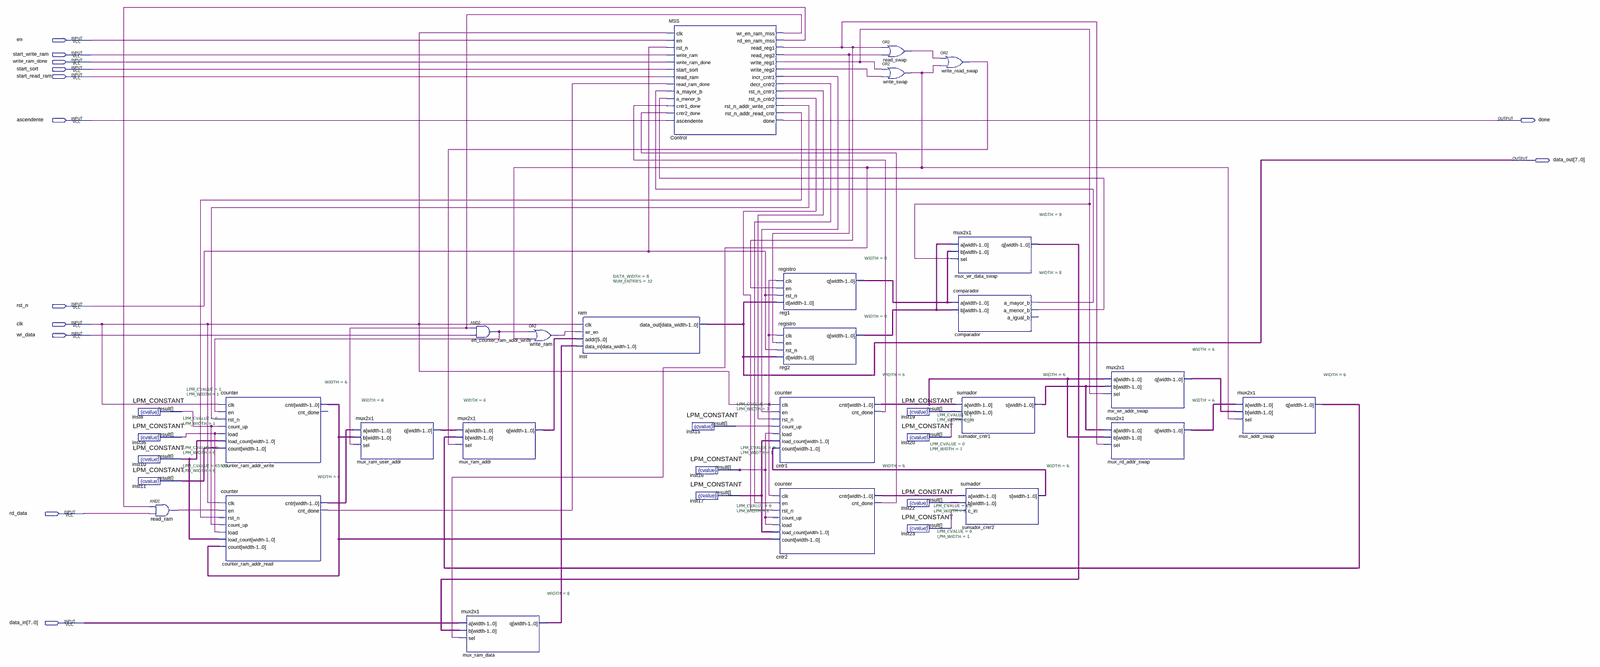
[diagram p0: schematic sheet, whole]
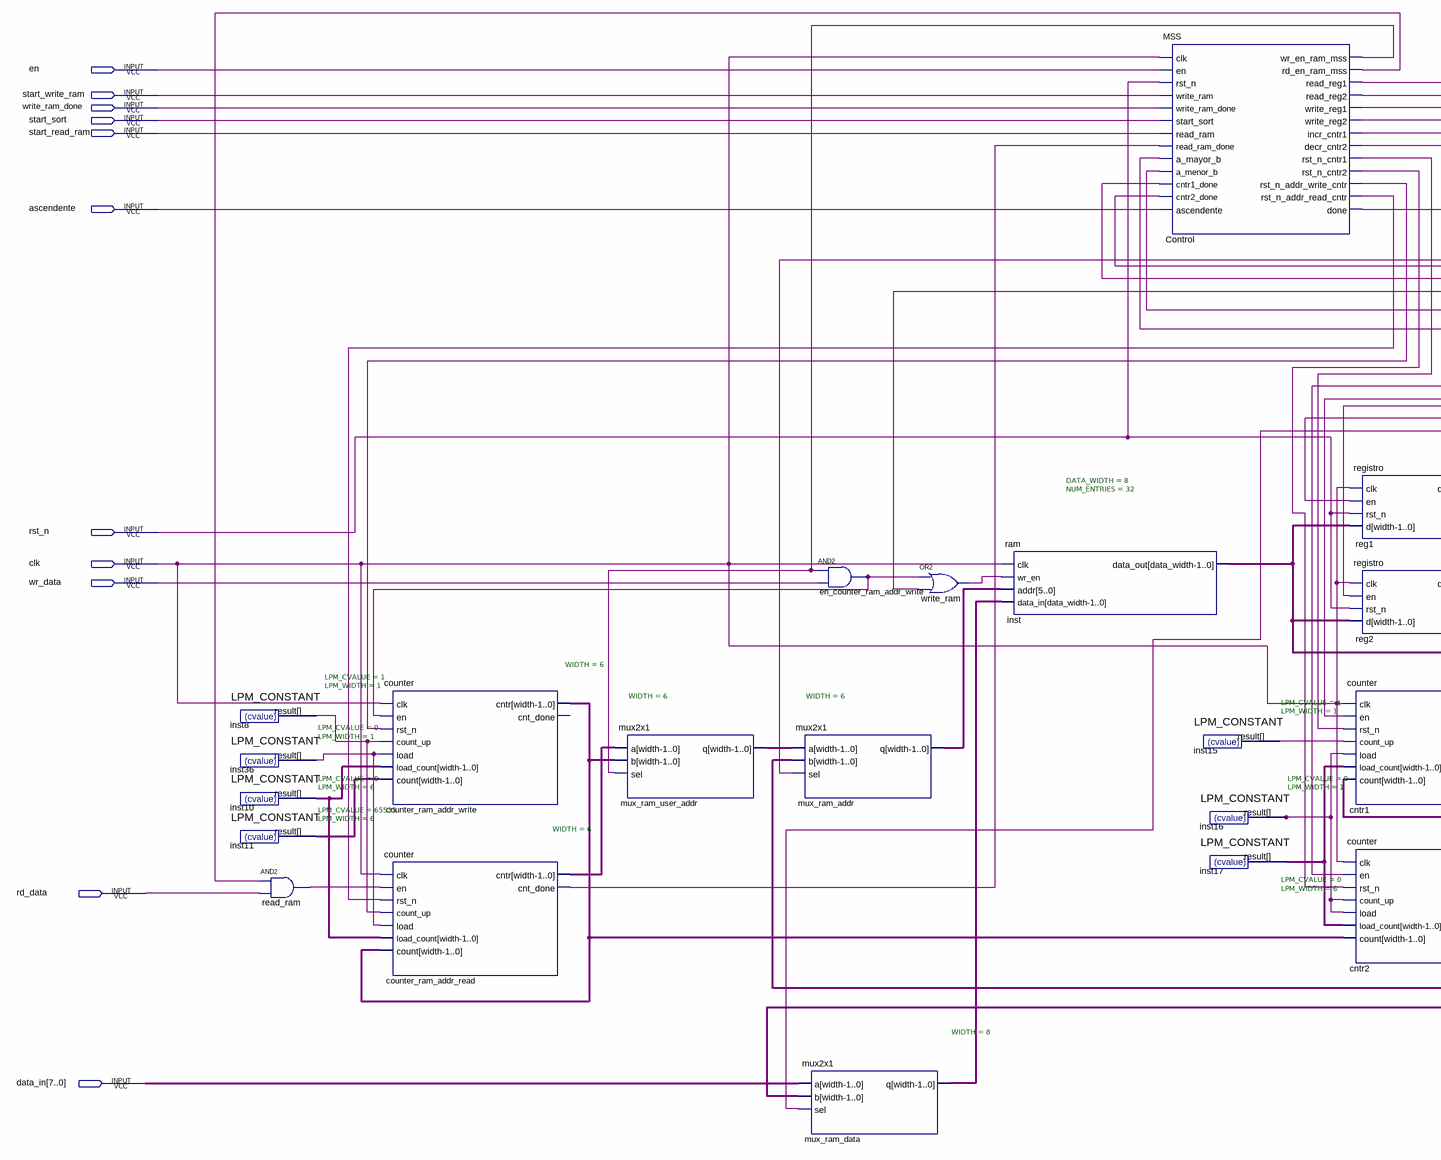
[diagram p1: schematic sheet, left part]
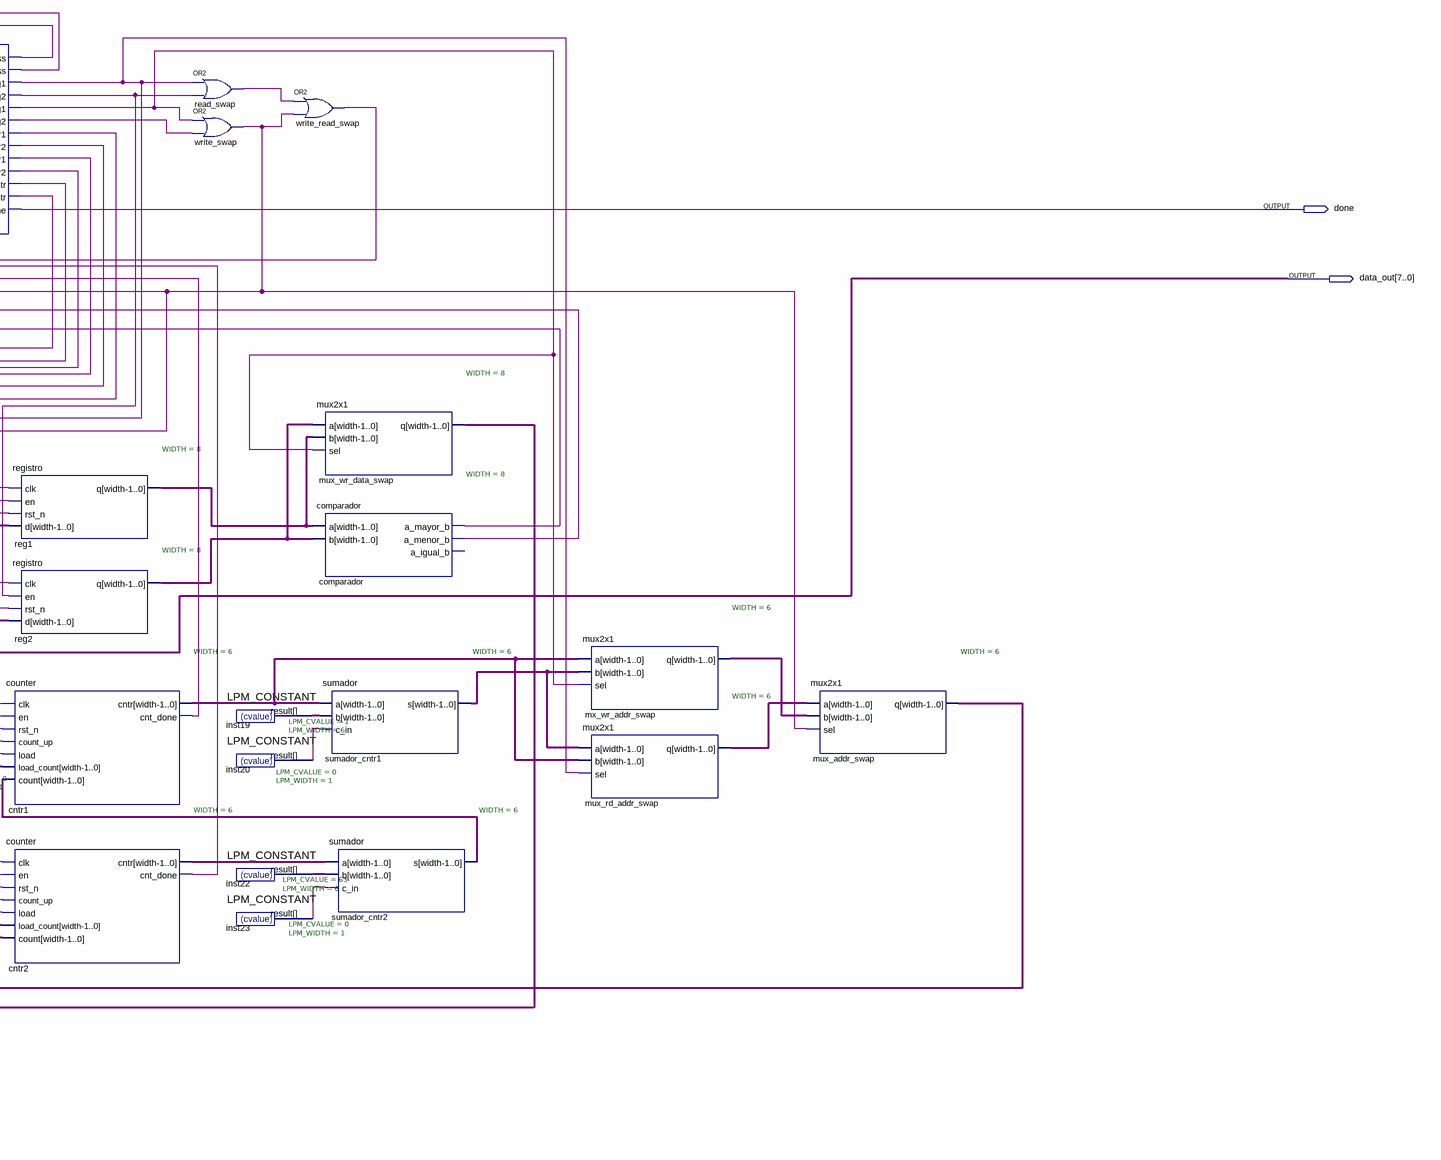
[diagram p2: schematic sheet, right part]
// Quartus schematic ram_bubble_sort.bdf as structural Verilog: 35 symbols, 13 pins
module ram_bubble_sort (
  input  en,
  input  start_write_ram,
  input  write_ram_done,
  input  start_sort,
  input  start_read_ram,
  input  ascendente,
  input  rst_n,
  input  clk,
  input  wr_data,
  input  rd_data,
  input  [7:0] data_in,
  output done,
  output [7:0] data_out
);

  wire cntr1_cnt_done, cntr2_cnt_done, comparador_a_mayor_b, comparador_a_menor_b, Control_decr_cntr2,
       Control_incr_cntr1, Control_rd_en_ram_mss, Control_read_reg1, Control_read_reg2,
       Control_rst_n_addr_read_cntr, Control_rst_n_addr_write_cntr, Control_rst_n_cntr1, Control_rst_n_cntr2,
       Control_wr_en_ram_mss, Control_write_reg1, Control_write_reg2, counter_ram_addr_read_cnt_done,
       en_counter_ram_addr_write_out, inst8_result, inst15_result, inst16_result, inst20_result,
       inst23_result, inst36_result, read_ram_out, read_swap_out, write_ram_out, write_read_swap_out,
       write_swap_out;
  wire [5:0] cntr1_cntr, cntr2_cntr, counter_ram_addr_read_cntr, counter_ram_addr_write_cntr, inst10_result,
       inst11_result, inst17_result, inst19_result, inst22_result, mux_addr_swap_q, mux_ram_addr_q,
       mux_ram_user_addr_q, mux_rd_addr_swap_q, mx_wr_addr_swap_q, sumador_cntr1_s, sumador_cntr2_s;
  wire [7:0] mux_ram_data_q, mux_wr_data_swap_q, reg1_q, reg2_q;

  LPM_CONSTANT #(.LPM_CVALUE(1), .LPM_WIDTH(1)) inst8 (.result(inst8_result));
  LPM_CONSTANT #(.LPM_CVALUE(0), .LPM_WIDTH(1)) inst36 (.result(inst36_result));
  LPM_CONSTANT #(.LPM_CVALUE(0), .LPM_WIDTH(6)) inst10 (.result(inst10_result));
  LPM_CONSTANT #(.LPM_CVALUE(65535), .LPM_WIDTH(6)) inst11 (.result(inst11_result));
  and read_ram (read_ram_out, Control_rd_en_ram_mss, rd_data);
  counter #(.WIDTH(6)) counter_ram_addr_write (
    .clk(clk), .en(en_counter_ram_addr_write_out), .rst_n(Control_rst_n_addr_write_cntr),
    .count_up(inst8_result), .load(inst36_result), .load_count(inst10_result), .count(inst11_result),
    .cntr(counter_ram_addr_write_cntr));  // open: cnt_done
  counter #(.WIDTH(6)) counter_ram_addr_read (
    .clk(clk), .en(read_ram_out), .rst_n(Control_rst_n_addr_read_cntr), .count_up(inst8_result),
    .load(inst36_result), .load_count(inst10_result), .count(counter_ram_addr_write_cntr),
    .cntr(counter_ram_addr_read_cntr), .cnt_done(counter_ram_addr_read_cnt_done));
  mux2x1 #(.WIDTH(6)) mux_ram_user_addr (
    .a(counter_ram_addr_read_cntr), .b(counter_ram_addr_write_cntr), .sel(Control_wr_en_ram_mss),
    .q(mux_ram_user_addr_q));
  mux2x1 #(.WIDTH(6)) mux_ram_addr (
    .a(mux_ram_user_addr_q), .b(mux_addr_swap_q), .sel(write_read_swap_out), .q(mux_ram_addr_q));
  and en_counter_ram_addr_write (en_counter_ram_addr_write_out, Control_wr_en_ram_mss, wr_data);
  mux2x1 #(.WIDTH(8)) mux_ram_data (.a(data_in), .b(mux_wr_data_swap_q), .sel(write_swap_out), .q(mux_ram_data_q));
  or write_ram (write_ram_out, en_counter_ram_addr_write_out, write_swap_out);
  ram #(.DATA_WIDTH(8), .NUM_ENTRIES(32)) inst (
    .clk(clk), .wr_en(write_ram_out), .addr(mux_ram_addr_q), .data_in(mux_ram_data_q), .data_out(data_out));
  MSS Control (
    .clk(clk), .en(en), .rst_n(rst_n), .write_ram(start_write_ram), .write_ram_done(write_ram_done),
    .start_sort(start_sort), .read_ram(start_read_ram), .read_ram_done(counter_ram_addr_read_cnt_done),
    .a_mayor_b(comparador_a_mayor_b), .a_menor_b(comparador_a_menor_b), .cntr1_done(cntr1_cnt_done),
    .cntr2_done(cntr2_cnt_done), .ascendente(ascendente), .wr_en_ram_mss(Control_wr_en_ram_mss),
    .rd_en_ram_mss(Control_rd_en_ram_mss), .read_reg1(Control_read_reg1), .read_reg2(Control_read_reg2),
    .write_reg1(Control_write_reg1), .write_reg2(Control_write_reg2), .incr_cntr1(Control_incr_cntr1),
    .decr_cntr2(Control_decr_cntr2), .rst_n_cntr1(Control_rst_n_cntr1), .rst_n_cntr2(Control_rst_n_cntr2),
    .rst_n_addr_write_cntr(Control_rst_n_addr_write_cntr),
    .rst_n_addr_read_cntr(Control_rst_n_addr_read_cntr), .done(done));
  LPM_CONSTANT #(.LPM_CVALUE(1), .LPM_WIDTH(1)) inst15 (.result(inst15_result));
  LPM_CONSTANT #(.LPM_CVALUE(0), .LPM_WIDTH(1)) inst16 (.result(inst16_result));
  LPM_CONSTANT #(.LPM_CVALUE(0), .LPM_WIDTH(6)) inst17 (.result(inst17_result));
  registro #(.WIDTH(8)) reg1 (.clk(clk), .en(Control_read_reg1), .rst_n(rst_n), .d(data_out), .q(reg1_q));
  registro #(.WIDTH(8)) reg2 (.clk(clk), .en(Control_read_reg2), .rst_n(rst_n), .d(data_out), .q(reg2_q));
  counter #(.WIDTH(6)) cntr1 (
    .clk(clk), .en(Control_incr_cntr1), .rst_n(Control_rst_n_cntr1), .count_up(inst15_result),
    .load(inst16_result), .load_count(inst17_result), .count(sumador_cntr2_s), .cntr(cntr1_cntr),
    .cnt_done(cntr1_cnt_done));
  counter #(.WIDTH(6)) cntr2 (
    .clk(clk), .en(Control_decr_cntr2), .rst_n(Control_rst_n_cntr2), .count_up(inst16_result),
    .load(inst16_result), .load_count(inst17_result), .count(counter_ram_addr_write_cntr), .cntr(cntr2_cntr),
    .cnt_done(cntr2_cnt_done));
  or read_swap (read_swap_out, Control_read_reg1, Control_read_reg2);
  or write_swap (write_swap_out, Control_write_reg1, Control_write_reg2);
  LPM_CONSTANT #(.LPM_CVALUE(1), .LPM_WIDTH(6)) inst19 (.result(inst19_result));
  LPM_CONSTANT #(.LPM_CVALUE(0), .LPM_WIDTH(1)) inst20 (.result(inst20_result));
  LPM_CONSTANT #(.LPM_CVALUE(63), .LPM_WIDTH(6)) inst22 (.result(inst22_result));
  LPM_CONSTANT #(.LPM_CVALUE(0), .LPM_WIDTH(1)) inst23 (.result(inst23_result));
  or write_read_swap (write_read_swap_out, read_swap_out, write_swap_out);
  mux2x1 #(.WIDTH(8)) mux_wr_data_swap (.a(reg2_q), .b(reg1_q), .sel(Control_write_reg1), .q(mux_wr_data_swap_q));
  comparador #(.WIDTH(8)) comparador (
    .a(reg1_q), .b(reg2_q), .a_mayor_b(comparador_a_mayor_b), .a_menor_b(comparador_a_menor_b));  // open: a_igual_b
  sumador #(.WIDTH(6)) sumador_cntr1 (.a(cntr1_cntr), .b(inst19_result), .c_in(inst20_result), .s(sumador_cntr1_s));
  sumador #(.WIDTH(6)) sumador_cntr2 (.a(cntr2_cntr), .b(inst22_result), .c_in(inst23_result), .s(sumador_cntr2_s));
  mux2x1 #(.WIDTH(6)) mx_wr_addr_swap (
    .a(cntr1_cntr), .b(sumador_cntr1_s), .sel(Control_write_reg1), .q(mx_wr_addr_swap_q));
  mux2x1 #(.WIDTH(6)) mux_rd_addr_swap (
    .a(sumador_cntr1_s), .b(cntr1_cntr), .sel(Control_read_reg1), .q(mux_rd_addr_swap_q));
  mux2x1 #(.WIDTH(6)) mux_addr_swap (
    .a(mux_rd_addr_swap_q), .b(mx_wr_addr_swap_q), .sel(write_swap_out), .q(mux_addr_swap_q));
endmodule
